# EasyEDA schematic SCH_Arithmetic Logic Unit_2021-10-03.json
TITLE: Arithmetic Logic Unit Electronic Scheme; REV: 1.0; Date: 2021-09-22; Sheet: 1/1; Drawn By: MarcosObel; Company: Zutup All Electronics
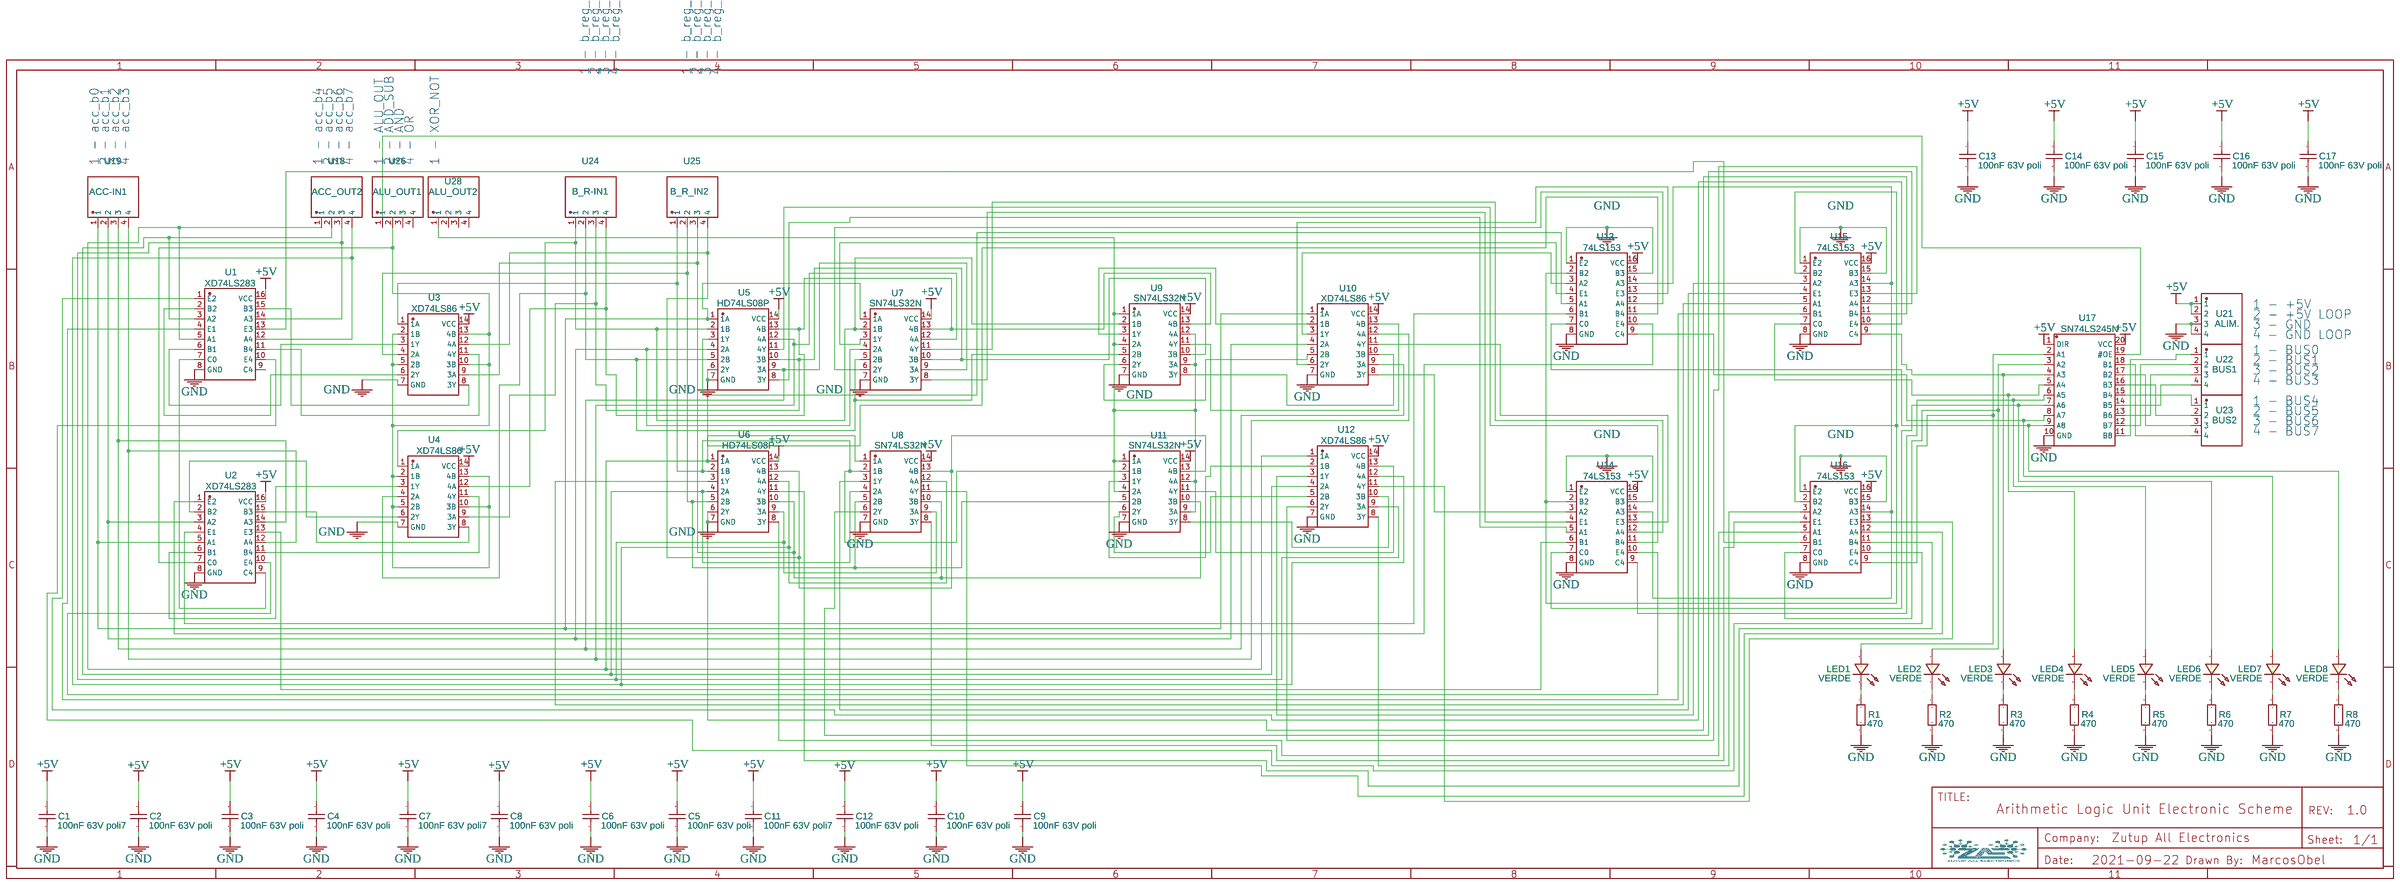
[diagram p0: schematic sheet]

## Parts
C1  100nF 63V poli7  [CAP-TH_L7.6-W3.8-P5.08-D0.51]
C2  100nF 63V poli  [CAP-TH_L7.6-W3.8-P5.08-D0.51]
C3  100nF 63V poli  [CAP-TH_L7.6-W3.8-P5.08-D0.51]
C4  100nF 63V poli  [CAP-TH_L7.6-W3.8-P5.08-D0.51]
C5  100nF 63V poli  [CAP-TH_L7.6-W3.8-P5.08-D0.51]
C6  100nF 63V poli  [CAP-TH_L7.6-W3.8-P5.08-D0.51]
C7  100nF 63V poli7  [CAP-TH_L7.6-W3.8-P5.08-D0.51]
C8  100nF 63V poli  [CAP-TH_L7.6-W3.8-P5.08-D0.51]
C9  100nF 63V poli  [CAP-TH_L7.6-W3.8-P5.08-D0.51]
C10  100nF 63V poli  [CAP-TH_L7.6-W3.8-P5.08-D0.51]
C11  100nF 63V poli7  [CAP-TH_L7.6-W3.8-P5.08-D0.51]
C12  100nF 63V poli  [CAP-TH_L7.6-W3.8-P5.08-D0.51]
C13  100nF 63V poli  [CAP-TH_L7.6-W3.8-P5.08-D0.51]
C14  100nF 63V poli  [CAP-TH_L7.6-W3.8-P5.08-D0.51]
C15  100nF 63V poli  [CAP-TH_L7.6-W3.8-P5.08-D0.51]
C16  100nF 63V poli  [CAP-TH_L7.6-W3.8-P5.08-D0.51]
C17  100nF 63V poli  [CAP-TH_L7.6-W3.8-P5.08-D0.51]
LED1  VERDE  [LED-TH_BD3.0-P2.54-RD-GREEN]
LED2  VERDE  [LED-TH_BD3.0-P2.54-RD-GREEN]
LED3  VERDE  [LED-TH_BD3.0-P2.54-RD-GREEN]
LED4  VERDE  [LED-TH_BD3.0-P2.54-RD-GREEN]
LED5  VERDE  [LED-TH_BD3.0-P2.54-RD-GREEN]
LED6  VERDE  [LED-TH_BD3.0-P2.54-RD-GREEN]
LED7  VERDE  [LED-TH_BD3.0-P2.54-RD-GREEN]
LED8  VERDE  [LED-TH_BD3.0-P2.54-RD-GREEN]
R1  470  [RES-TH_BD3.0-L9.5-P13.50-D0.6]
R2  470  [RES-TH_BD3.0-L9.5-P13.50-D0.6]
R3  470  [RES-TH_BD3.0-L9.5-P13.50-D0.6]
R4  470  [RES-TH_BD3.0-L9.5-P13.50-D0.6]
R5  470  [RES-TH_BD3.0-L9.5-P13.50-D0.6]
R6  470  [RES-TH_BD3.0-L9.5-P13.50-D0.6]
R7  470  [RES-TH_BD3.0-L9.5-P13.50-D0.6]
R8  470  [RES-TH_BD3.0-L9.5-P13.50-D0.6]
U1  XD74LS283  [DIP-16_L19.8-W6.5-P2.54-LS7.6-BL]
U2  XD74LS283  [DIP-16_L19.8-W6.5-P2.54-LS7.6-BL]
U3  XD74LS86  [DIP-14_L20.0-W7.6-P2.54-LS7.6-BL]
U4  XD74LS86  [DIP-14_L20.0-W7.6-P2.54-LS7.6-BL]
U5  HD74LS08P  [DIP-14_L19.4-W6.4-P2.54-LS7.6-BL]
U6  HD74LS08P  [DIP-14_L19.4-W6.4-P2.54-LS7.6-BL]
U7  SN74LS32N  [PDIP-14_L19.6-W6.5-P2.54-LS7.9-BL]
U8  SN74LS32N  [PDIP-14_L19.6-W6.5-P2.54-LS7.9-BL]
U9  SN74LS32N  [PDIP-14_L19.6-W6.5-P2.54-LS7.9-BL]
U10  XD74LS86  [DIP-14_L20.0-W7.6-P2.54-LS7.6-BL]
U11  SN74LS32N  [PDIP-14_L19.6-W6.5-P2.54-LS7.9-BL]
U12  XD74LS86  [DIP-14_L20.0-W7.6-P2.54-LS7.6-BL]
U13  74LS153  [DIP-16_L19.8-W6.5-P2.54-LS7.6-BL]
U14  74LS153  [DIP-16_L19.8-W6.5-P2.54-LS7.6-BL]
U15  74LS153  [DIP-16_L19.8-W6.5-P2.54-LS7.6-BL]
U16  74LS153  [DIP-16_L19.8-W6.5-P2.54-LS7.6-BL]
U17  SN74LS245N  [DIP-20_L25.5-W10.0-P2.54-LS7.6-BL]
U18  ACC_OUT2  [HDR-TH_4P-P2.54-D1.0]
U19  ACC-IN1  [HDR-TH_4P-P2.54-D1.0]
U21  ALIM.  [HDR-TH_4P-P2.54-D1.0]
U22  BUS1  [HDR-TH_4P-P2.54-D1.0]
U23  BUS2  [HDR-TH_4P-P2.54-D1.0]
U24  B_R-IN1  [HDR-TH_4P-P2.54-D1.0]
U25  B_R_IN2  [HDR-TH_4P-P2.54-D1.0]
U26  ALU_OUT1  [HDR-TH_4P-P2.54-D1.0]
U28  ALU_OUT2  [HDR-TH_4P-P2.54-D1.0]

## Library data of the parts
C1-C17 = SR305C105KAR: Supplier: LCSC; Supplier Part: C444741; Manufacturer: AVX; Contributor: LCSC; JLCPCB Part Class: Extended Part
LED1-LED8 = 264-7GD: Supplier: LCSC; Supplier Part: C605465; Manufacturer: Everlight Elec; Contributor: LCSC; JLCPCB Part Class: Extended Part
R1-R8 = CFR02SJ0823A10: Supplier: LCSC; Manufacturer: UniOhm; Supplier Part: C69876
U1 U2 U13-U16 = XD74LS283: Supplier: LCSC; Supplier Part: C561301; Manufacturer: XINLUDA; Contributor: LCSC; JLCPCB Part Class: Extended Part
U3 U4 U10 U12 = XD74LS86: Supplier: LCSC; Supplier Part: C556290; Manufacturer: XINLUDA; Contributor: LCSC; JLCPCB Part Class: Extended Part
U5 U6 = HD74LS08P: Supplier: LCSC; Supplier Part: C5270; Manufacturer: RENESAS(瑞萨)/IDT; Contributor: LCSC; JLCPCB Part Class: Extended Part
U7-U9 U11 = SN74LS32N: Supplier: LCSC; Supplier Part: C273644; Manufacturer: TI(德州仪器); Contributor: LCSC; JLCPCB Part Class: Extended Part
U17 = SN74LS245N: Supplier: LCSC; Supplier Part: C352966; Manufacturer: Texas Instruments; Contributor: LCSC; JLCPCB Part Class: Extended Part
U18 U19 U21-U26 U28 = 171825-4: Supplier: LCSC; Supplier Part: C210162; Manufacturer: TE Connectivity; Contributor: LCSC; JLCPCB Part Class: Extended Part

## Nets
+5V: C1.1 C2.1 C3.1 C4.1 C5.1 C6.1 C7.1 C8.1 C9.1 C10.1 C11.1 C12.1 C13.1 C14.1 C15.1 C16.1 C17.1 U1.16(VCC) U2.16(VCC) U3.14(VCC) U4.14(VCC) U5.14(VCC) U6.14(VCC) U7.14(VCC) U8.14(VCC) U9.14(VCC) U10.14(VCC) U11.14(VCC) U12.14(VCC) U13.16(VCC) U14.16(VCC) U15.16(VCC) U16.16(VCC) U17.1(DIR) U17.20(VCC) U21.1 U21.2
GND: C1.2 C2.2 C3.2 C4.2 C5.2 C6.2 C7.2 C8.2 C9.2 C10.2 C11.2 C12.2 C13.2 C14.2 C15.2 C16.2 C17.2 R1.2 R2.2 R3.2 R4.2 R5.2 R6.2 R7.2 R8.2 U1.8(GND) U2.8(GND) U3.7(GND) U4.7(GND) U5.6(2Y) U5.7(GND) U6.6(2Y) U6.7(GND) U7.7(GND) U8.7(GND) U9.7(GND) U10.7(GND) U11.7(GND) U12.7(GND) U13.1(E2) U13.8(GND) U13.11(B4) U13.15(B3) U14.1(E2) U14.8(GND) U14.15(B3) U15.1(E2) U15.8(GND) U15.11(B4) U15.15(B3) U16.1(E2) U16.8(GND) U16.15(B3) U17.10(GND) U21.3 U21.4
Net-(LED1-1): LED1.1(-) R1.1
Net-(LED1-2): LED1.2(+) U16.9(C4) U17.2(A1)
Net-(LED2-1): LED2.1(-) R2.1
Net-(LED2-2): LED2.2(+) U16.7(C0) U17.3(A2)
Net-(LED3-1): LED3.1(-) R3.1
Net-(LED3-2): LED3.2(+) U15.9(C4) U17.4(A3)
Net-(LED4-1): LED4.1(-) R4.1
Net-(LED4-2): LED4.2(+) U15.7(C0) U17.5(A4)
Net-(LED5-1): LED5.1(-) R5.1
Net-(LED5-2): LED5.2(+) U14.9(C4) U17.6(A5)
Net-(LED6-1): LED6.1(-) R6.1
Net-(LED6-2): LED6.2(+) U14.7(C0) U17.7(A6)
Net-(LED7-1): LED7.1(-) R7.1
Net-(LED7-2): LED7.2(+) U13.9(C4) U17.8(A7)
Net-(LED8-1): LED8.1(-) R8.1
Net-(LED8-2): LED8.2(+) U13.7(C0) U17.9(A8)
Net-(U1-1): U1.1(E2) U15.10(E4)
Net-(U1-2): U1.2(B2) U3.6(2Y)
Net-(U1-3): U1.3(A2) U6.4(2A) U8.4(2A) U12.4(2A) U18.2
Net-(U1-4): U1.4(E1) U15.6(B1)
Net-(U1-5): U1.5(A1) U6.1(1A) U8.1(1A) U12.1(1A) U18.1
Net-(U1-6): U1.6(B1) U3.3(1Y)
Net-(U1-7): U1.7(C0) U2.9(C4)
Net-(U1-10): U1.10(E4) U16.10(E4)
Net-(U1-11): U1.11(B4) U3.11(4Y)
Net-(U1-12): U1.12(A4) U6.12(4A) U8.12(4A) U12.12(4A) U18.4
Net-(U1-13): U1.13(E3) U16.6(B1)
Net-(U1-14): U1.14(A3) U6.9(3A) U8.9(3A) U12.9(3A) U18.3
Net-(U1-15): U1.15(B3) U3.8(3Y)
Net-(U2-1): U2.1(E2) U13.10(E4)
Net-(U2-2): U2.2(B2) U4.6(2Y)
Net-(U2-3): U2.3(A2) U5.4(2A) U7.4(2A) U10.4(2A) U19.2
Net-(U2-4): U2.4(E1) U13.6(B1)
Net-(U2-5): U2.5(A1) U5.1(1A) U7.1(1A) U10.1(1A) U19.1
Net-(U2-6): U2.6(B1) U4.3(1Y)
Net-(U2-7): U2.7(C0) U3.2(1B) U3.5(2B) U3.10(3B) U3.13(4B) U4.2(1B) U4.5(2B) U4.10(3B) U4.13(4B) U26.2
Net-(U2-10): U2.10(E4) U14.10(E4)
Net-(U2-11): U2.11(B4) U4.11(4Y)
Net-(U2-12): U2.12(A4) U5.12(4A) U7.12(4A) U10.12(4A) U19.4
Net-(U2-13): U2.13(E3) U14.6(B1)
Net-(U2-14): U2.14(A3) U5.9(3A) U7.9(3A) U10.9(3A) U19.3
Net-(U2-15): U2.15(B3) U4.8(3Y)
Net-(U3-1): U3.1(1A) U6.2(1B) U8.2(1B) U11.2(1B) U25.1
Net-(U3-4): U3.4(2A) U6.5(2B) U8.5(2B) U11.5(2B) U25.2
Net-(U3-9): U3.9(3A) U6.10(3B) U8.10(3B) U11.10(3B) U25.3
Net-(U3-12): U3.12(4A) U6.13(4B) U8.13(4B) U11.13(4B) U25.4
Net-(U4-1): U4.1(1A) U5.2(1B) U7.2(1B) U9.2(1B) U24.1
Net-(U4-4): U4.4(2A) U5.5(2B) U7.5(2B) U9.5(2B) U24.2
Net-(U4-9): U4.9(3A) U5.10(3B) U7.10(3B) U9.10(3B) U24.3
Net-(U4-12): U4.12(4A) U5.13(4B) U7.13(4B) U9.13(4B) U24.4
Net-(U5-3): U5.3(1Y) U13.5(A1)
Net-(U5-8): U5.8(3Y) U14.5(A1)
Net-(U5-11): U5.11(4Y) U14.11(B4)
Net-(U6-3): U6.3(1Y) U15.5(A1)
Net-(U6-8): U6.8(3Y) U16.5(A1)
Net-(U6-11): U6.11(4Y) U16.11(B4)
Net-(U7-3): U7.3(1Y) U13.4(E1)
Net-(U7-6): U7.6(2Y) U13.12(A4)
Net-(U7-8): U7.8(3Y) U14.4(E1)
Net-(U7-11): U7.11(4Y) U14.12(A4)
Net-(U8-3): U8.3(1Y) U15.4(E1)
Net-(U8-6): U8.6(2Y) U15.12(A4)
Net-(U8-8): U8.8(3Y) U16.4(E1)
Net-(U8-11): U8.11(4Y) U16.12(A4)
Net-(U9-1): U9.1(1A) U9.4(2A) U9.9(3A) U9.12(4A) U11.1(1A) U11.4(2A) U11.9(3A) U11.12(4A) U28.1
Net-(U9-3): U9.3(1Y) U10.2(1B)
Net-(U9-6): U9.6(2Y) U10.5(2B)
Net-(U9-8): U9.8(3Y) U10.10(3B)
Net-(U9-11): U9.11(4Y) U10.13(4B)
Net-(U10-3): U10.3(1Y) U13.3(A2)
Net-(U10-6): U10.6(2Y) U13.13(E3)
Net-(U10-8): U10.8(3Y) U14.3(A2)
Net-(U10-11): U10.11(4Y) U14.13(E3)
Net-(U11-3): U11.3(1Y) U12.2(1B)
Net-(U11-6): U11.6(2Y) U12.5(2B)
Net-(U11-8): U11.8(3Y) U12.10(3B)
Net-(U11-11): U11.11(4Y) U12.13(4B)
Net-(U12-3): U12.3(1Y) U15.3(A2)
Net-(U12-6): U12.6(2Y) U15.13(E3)
Net-(U12-8): U12.8(3Y) U16.3(A2)
Net-(U12-11): U12.11(4Y) U16.13(E3)
Net-(U13-2): U13.2(B2) U14.2(B2) U15.2(B2) U16.2(B2)
Net-(U13-14): U13.14(A3) U14.14(A3) U15.14(A3) U16.14(A3)
Net-(U17-11): U17.11(B8) U22.1
Net-(U17-12): U17.12(B7) U22.2
Net-(U17-13): U17.13(B6) U22.3
Net-(U17-14): U17.14(B5) U22.4
Net-(U17-15): U17.15(B4) U23.1
Net-(U17-16): U17.16(B3) U23.2
Net-(U17-17): U17.17(B2) U23.3
Net-(U17-18): U17.18(B1) U23.4
Net-(U17-19): U17.19(#OE) U26.1

Not connected (* = marked no-connect by the designer): U1 9(C4); U26 3 4; U28 2 3 4

## Notes on the sheet
- 1 - b_reg_b0
- 2 - b_reg_b1
- 3 - b_reg_b2
- 4 - b_reg_b3
- 1 - b_reg_b4
- 2 - b_reg_b5
- 3 - b_reg_b6
- 4 - b_reg_b7
- 1 - acc_b0
- 2 - acc_b1
- 3 - acc_b2
- 4 - acc_b3
- 1 - acc_b4
- 2 - acc_b5
- 3 - acc_b6
- 4 - acc_b7
- 1 - ALU_OUT
- 2 - ADD_SUB
- 3 - AND
- 4 - OR
- 1 - XOR_NOT
- 1 - +5V
- 2 - +5V LOOP
- 3 - GND
- 4 - GND LOOP
- 1 - BUS0
- 2 - BUS1
- 3 - BUS2
- 4 - BUS3
- 1 - BUS4
- 2 - BUS5
- 3 - BUS6
- 4 - BUS7
